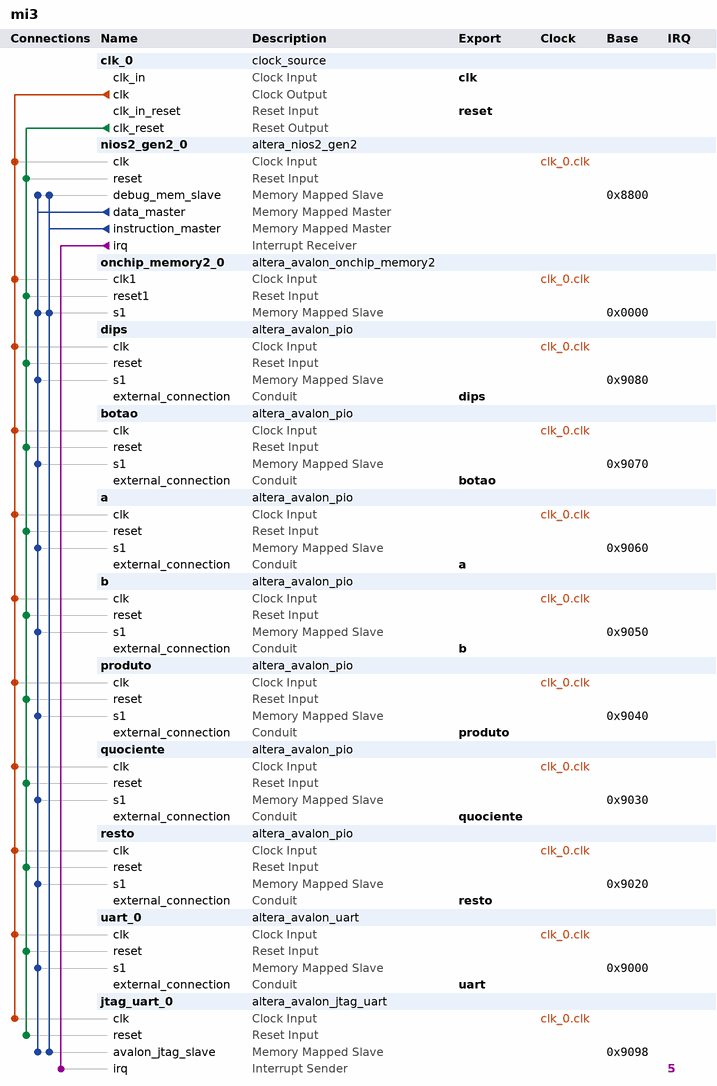
[diagram p0: system contents]
# Platform Designer (Qsys) system mi3, Cyclone IV E EP4CE30F23C7
# Parameters at their usual value, and those the tool derives, are not listed.
package require -exact qsys 16.1
create_system mi3
set_project_property DEVICE_FAMILY {Cyclone IV E}
set_project_property DEVICE EP4CE30F23C7

add_instance clk_0 clock_source 16.1
set_instance_parameter_value clk_0 clockFrequency 50000000

add_instance nios2_gen2_0 altera_nios2_gen2 16.1
set_instance_parameter_value nios2_gen2_0 dcache_size 2048
set_instance_parameter_value nios2_gen2_0 exceptionSlave onchip_memory2_0.s1
set_instance_parameter_value nios2_gen2_0 icache_size 4096
set_instance_parameter_value nios2_gen2_0 impl Fast
set_instance_parameter_value nios2_gen2_0 resetSlave onchip_memory2_0.s1

add_instance onchip_memory2_0 altera_avalon_onchip_memory2 16.1
set_instance_parameter_value onchip_memory2_0 dataWidth 32
set_instance_parameter_value onchip_memory2_0 dualPort false
set_instance_parameter_value onchip_memory2_0 initMemContent true
set_instance_parameter_value onchip_memory2_0 initializationFileName C:/intelFPGA_lite/16.1/mi3/mi3_onchip_memory2_0.hex
set_instance_parameter_value onchip_memory2_0 memorySize 20480
set_instance_parameter_value onchip_memory2_0 useNonDefaultInitFile true

add_instance dips altera_avalon_pio 16.1
set_instance_parameter_value dips direction Input
set_instance_parameter_value dips width 4

add_instance botao altera_avalon_pio 16.1
set_instance_parameter_value botao direction Output
set_instance_parameter_value botao width 1

add_instance a altera_avalon_pio 16.1
set_instance_parameter_value a direction Output
set_instance_parameter_value a width 32

add_instance b altera_avalon_pio 16.1
set_instance_parameter_value b direction Output
set_instance_parameter_value b width 32

add_instance produto altera_avalon_pio 16.1
set_instance_parameter_value produto direction Input
set_instance_parameter_value produto width 32

add_instance quociente altera_avalon_pio 16.1
set_instance_parameter_value quociente direction Input
set_instance_parameter_value quociente width 32

add_instance resto altera_avalon_pio 16.1
set_instance_parameter_value resto direction Input
set_instance_parameter_value resto width 32

add_instance uart_0 altera_avalon_uart 16.1
set_instance_parameter_value uart_0 baud 9600
set_instance_parameter_value uart_0 dataBits 8
set_instance_parameter_value uart_0 fixedBaud true
set_instance_parameter_value uart_0 parity NONE
set_instance_parameter_value uart_0 stopBits 1

add_instance jtag_uart_0 altera_avalon_jtag_uart 16.1
set_instance_parameter_value jtag_uart_0 simInteractiveOptions NO_INTERACTIVE_WINDOWS

# connections
add_connection clk_0.clk a.clk clock
add_connection clk_0.clk b.clk clock
add_connection clk_0.clk botao.clk clock
add_connection clk_0.clk dips.clk clock
add_connection clk_0.clk jtag_uart_0.clk clock
add_connection clk_0.clk nios2_gen2_0.clk clock
add_connection clk_0.clk onchip_memory2_0.clk1 clock
add_connection clk_0.clk produto.clk clock
add_connection clk_0.clk quociente.clk clock
add_connection clk_0.clk resto.clk clock
add_connection clk_0.clk uart_0.clk clock
add_connection clk_0.clk_reset a.reset reset
add_connection clk_0.clk_reset b.reset reset
add_connection clk_0.clk_reset botao.reset reset
add_connection clk_0.clk_reset dips.reset reset
add_connection clk_0.clk_reset jtag_uart_0.reset reset
add_connection clk_0.clk_reset nios2_gen2_0.reset reset
add_connection clk_0.clk_reset onchip_memory2_0.reset1 reset
add_connection clk_0.clk_reset produto.reset reset
add_connection clk_0.clk_reset quociente.reset reset
add_connection clk_0.clk_reset resto.reset reset
add_connection clk_0.clk_reset uart_0.reset reset
add_connection nios2_gen2_0.data_master a.s1 avalon
set_connection_parameter_value nios2_gen2_0.data_master/a.s1 baseAddress 0x9060
add_connection nios2_gen2_0.data_master b.s1 avalon
set_connection_parameter_value nios2_gen2_0.data_master/b.s1 baseAddress 0x9050
add_connection nios2_gen2_0.data_master botao.s1 avalon
set_connection_parameter_value nios2_gen2_0.data_master/botao.s1 baseAddress 0x9070
add_connection nios2_gen2_0.data_master dips.s1 avalon
set_connection_parameter_value nios2_gen2_0.data_master/dips.s1 baseAddress 0x9080
add_connection nios2_gen2_0.data_master jtag_uart_0.avalon_jtag_slave avalon
set_connection_parameter_value nios2_gen2_0.data_master/jtag_uart_0.avalon_jtag_slave baseAddress 0x9098
add_connection nios2_gen2_0.data_master nios2_gen2_0.debug_mem_slave avalon
set_connection_parameter_value nios2_gen2_0.data_master/nios2_gen2_0.debug_mem_slave baseAddress 0x8800
add_connection nios2_gen2_0.data_master onchip_memory2_0.s1 avalon
set_connection_parameter_value nios2_gen2_0.data_master/onchip_memory2_0.s1 baseAddress 0x0000
add_connection nios2_gen2_0.data_master produto.s1 avalon
set_connection_parameter_value nios2_gen2_0.data_master/produto.s1 baseAddress 0x9040
add_connection nios2_gen2_0.data_master quociente.s1 avalon
set_connection_parameter_value nios2_gen2_0.data_master/quociente.s1 baseAddress 0x9030
add_connection nios2_gen2_0.data_master resto.s1 avalon
set_connection_parameter_value nios2_gen2_0.data_master/resto.s1 baseAddress 0x9020
add_connection nios2_gen2_0.data_master uart_0.s1 avalon
set_connection_parameter_value nios2_gen2_0.data_master/uart_0.s1 baseAddress 0x9000
add_connection nios2_gen2_0.instruction_master jtag_uart_0.avalon_jtag_slave avalon
set_connection_parameter_value nios2_gen2_0.instruction_master/jtag_uart_0.avalon_jtag_slave baseAddress 0x9098
add_connection nios2_gen2_0.instruction_master nios2_gen2_0.debug_mem_slave avalon
set_connection_parameter_value nios2_gen2_0.instruction_master/nios2_gen2_0.debug_mem_slave baseAddress 0x8800
add_connection nios2_gen2_0.instruction_master onchip_memory2_0.s1 avalon
set_connection_parameter_value nios2_gen2_0.instruction_master/onchip_memory2_0.s1 baseAddress 0x0000
add_connection nios2_gen2_0.irq jtag_uart_0.irq interrupt
set_connection_parameter_value nios2_gen2_0.irq/jtag_uart_0.irq irqNumber 5

# exported interfaces
add_interface a conduit end
set_interface_property a EXPORT_OF a.external_connection
add_interface b conduit end
set_interface_property b EXPORT_OF b.external_connection
add_interface botao conduit end
set_interface_property botao EXPORT_OF botao.external_connection
add_interface clk clock sink
set_interface_property clk EXPORT_OF clk_0.clk_in
add_interface dips conduit end
set_interface_property dips EXPORT_OF dips.external_connection
add_interface produto conduit end
set_interface_property produto EXPORT_OF produto.external_connection
add_interface quociente conduit end
set_interface_property quociente EXPORT_OF quociente.external_connection
add_interface reset reset sink
set_interface_property reset EXPORT_OF clk_0.clk_in_reset
add_interface resto conduit end
set_interface_property resto EXPORT_OF resto.external_connection
add_interface uart conduit end
set_interface_property uart EXPORT_OF uart_0.external_connection

set_interconnect_requirement {$system} qsys_mm.clockCrossingAdapter HANDSHAKE
set_interconnect_requirement {$system} qsys_mm.enableEccProtection FALSE
set_interconnect_requirement {$system} qsys_mm.insertDefaultSlave FALSE
set_interconnect_requirement {$system} qsys_mm.maxAdditionalLatency 1

save_system mi3.qsys
